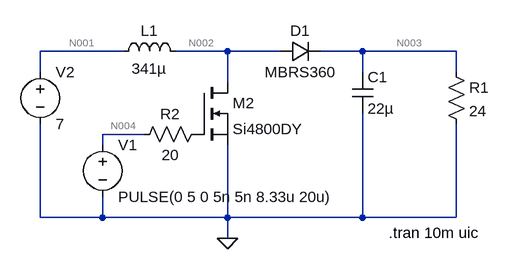
[diagram p0: schematic task1.asc]
task1.asc, the LTspice schematic file:
Version 4.1
SHEET 1 972 680
WIRE 160 128 32 128
WIRE 320 128 240 128
WIRE 400 128 320 128
WIRE 528 128 464 128
WIRE 672 128 528 128
WIRE 32 160 32 128
WIRE 528 160 528 128
WIRE 672 160 672 128
WIRE 320 176 320 128
WIRE 192 256 128 256
WIRE 128 272 128 256
WIRE 32 384 32 240
WIRE 128 384 128 352
WIRE 128 384 32 384
WIRE 320 384 320 272
WIRE 320 384 128 384
WIRE 528 384 528 224
WIRE 528 384 320 384
WIRE 672 384 672 240
WIRE 672 384 528 384
WIRE 320 416 320 384
FLAG 320 416 0
SYMBOL diode 400 144 R270
WINDOW 0 32 32 VTop 2
WINDOW 3 0 32 VBottom 2
SYMATTR InstName D1
SYMATTR Value MBRS360
SYMBOL cap 512 160 R0
SYMATTR InstName C1
SYMATTR Value 22µ
SYMBOL res 656 144 R0
SYMATTR InstName R1
SYMATTR Value 24
SYMBOL nmos 272 176 R0
SYMATTR InstName M2
SYMATTR Value Si4800DY
SYMBOL res 288 240 R90
WINDOW 0 0 56 VBottom 2
WINDOW 3 32 56 VTop 2
SYMATTR InstName R2
SYMATTR Value 20
SYMBOL voltage 128 256 R0
SYMATTR InstName V1
SYMATTR Value PULSE(0 5 0 5n 5n 8.33u 20u)
SYMBOL voltage 32 144 R0
WINDOW 123 0 0 Left 0
WINDOW 39 0 0 Left 0
SYMATTR InstName V2
SYMATTR Value 7
SYMBOL ind 144 144 R270
WINDOW 0 32 56 VTop 2
WINDOW 3 5 56 VBottom 2
SYMATTR InstName L1
SYMATTR Value 341µ
SYMATTR SpiceLine Rser=1m
TEXT 568 408 Left 2 !.tran 10m uic

The netlist it stands for:
* task1.asc
D1 N002 N003 MBRS360
C1 N003 0 22µ
R1 N003 0 24
M2 N002 P001 0 0 Si4800DY
R2 P001 N004 20
V1 N004 0 PULSE(0 5 0 5n 5n 8.33u 20u)
V2 N001 0 7
L1 N001 N002 341µ Rser=1m
.model D D
.lib standard.dio
.model NMOS NMOS
.model PMOS PMOS
.lib standard.mos
.tran 10m uic
.backanno
.end

* Results of the author's LTspice run, read from the files saved beside the schematic
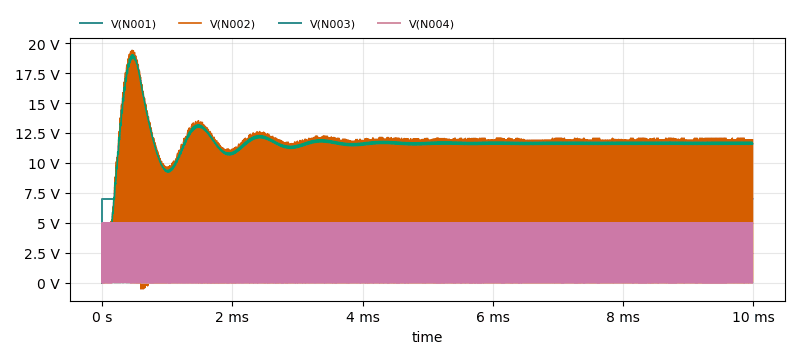
[diagram p1: Transient Analysis of task1.asc, plotted from the saved traces]
* Transient Analysis, 1 run:
*   V(N001): min 0 V, max 7 V, average 7 V, rms 7 V, last 7 V
*   V(N002): min -508 mV, max 19.4 V, average 6.974 V, rms 9.224 V, last 12.06 V
*   V(N003): min 0 V, max 19.03 V, average 11.65 V, rms 11.78 V, last 11.74 V
*   V(N004): min 0 V, max 5 V, average 2.084 V, rms 3.228 V, last 0 V